# EAGLE design level-shifter (EAGLE 5.07)
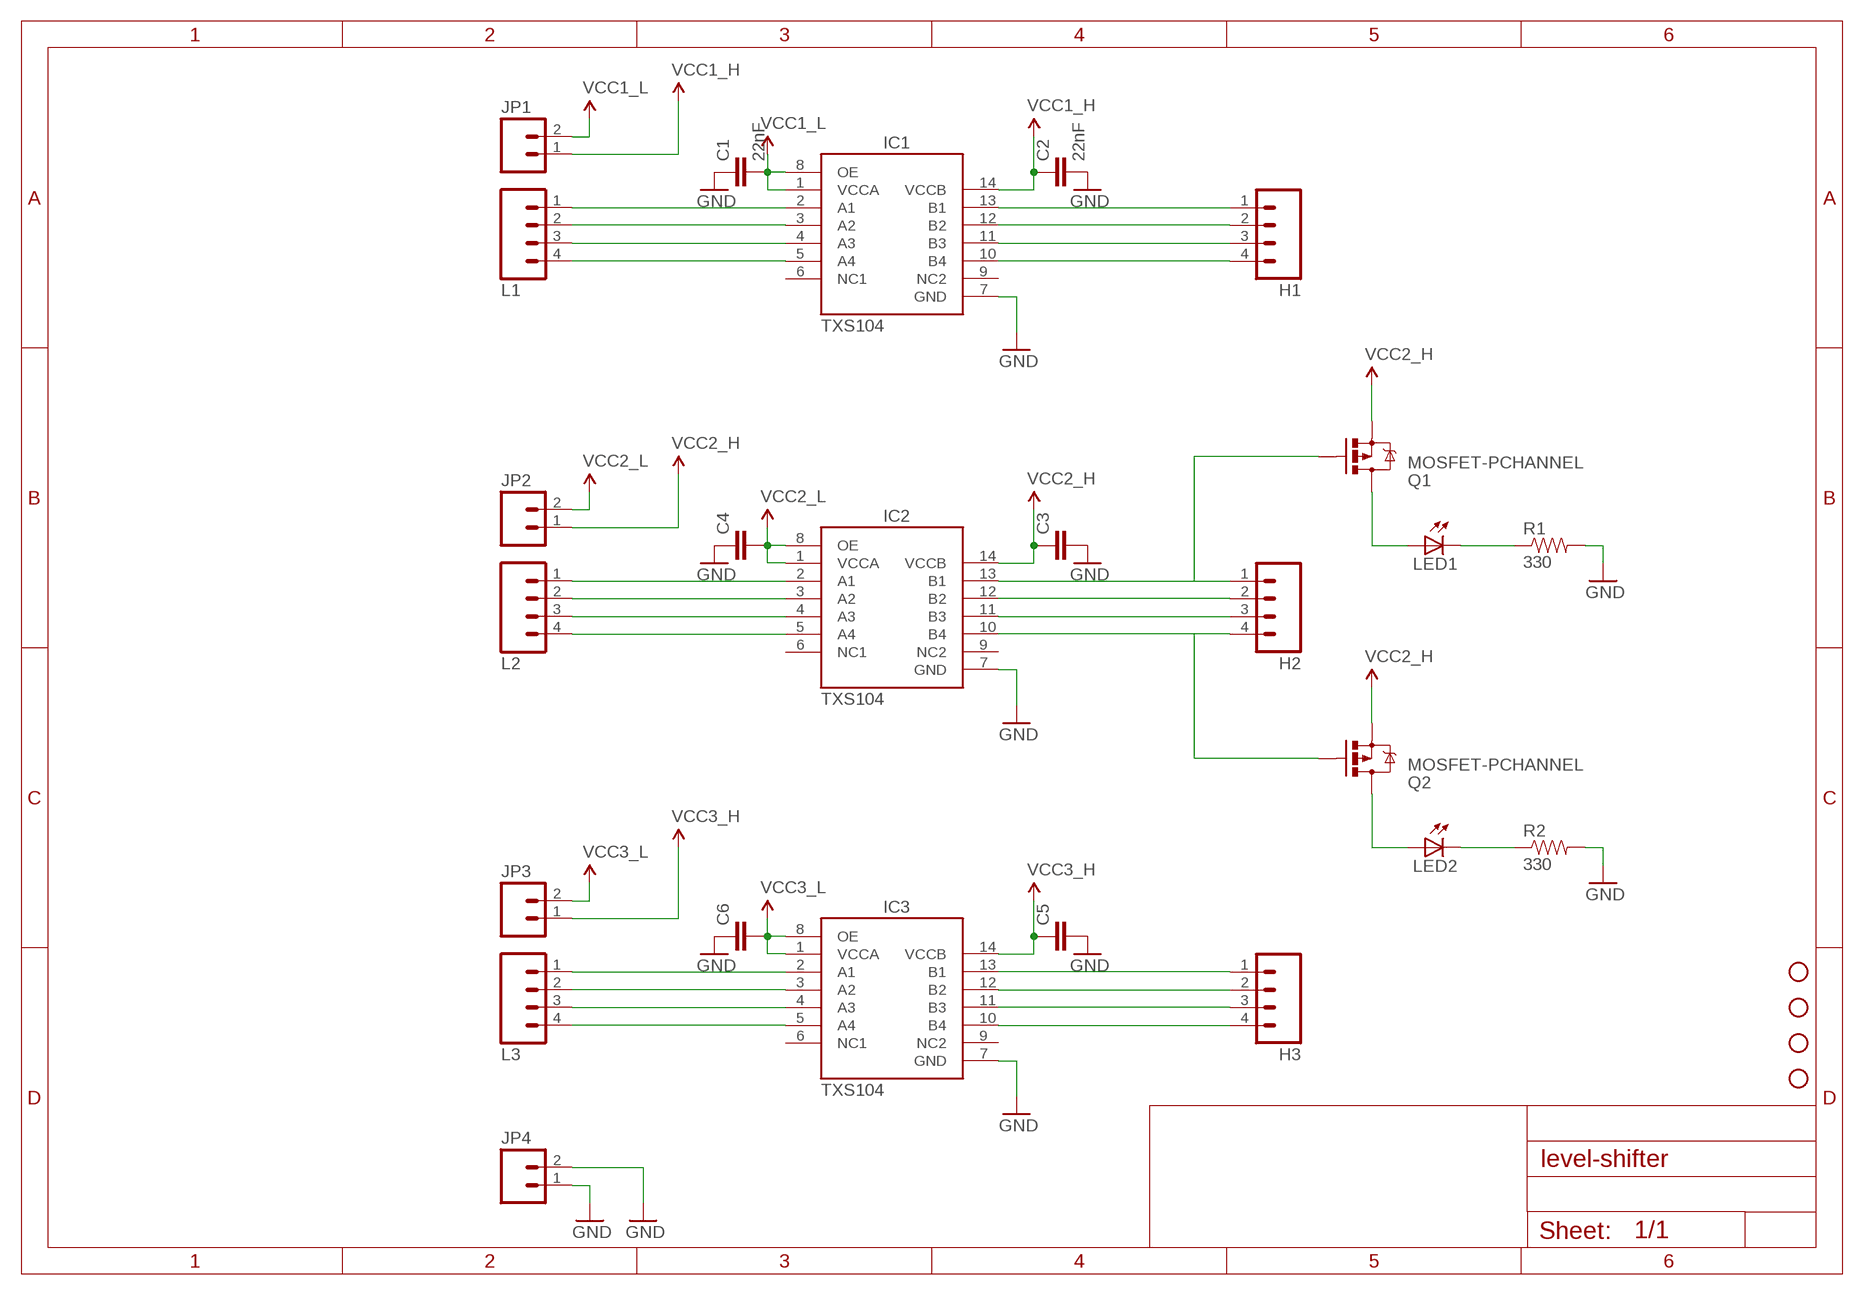
[diagram p0: schematic, sheet 1]

## Parts
C1  22nF  CAP1206  [1206]
C2  22nF  CAP1206  [1206]
C3  CAP1206  [1206]
C4  CAP1206  [1206]
C5  CAP1206  [1206]
C6  CAP1206  [1206]
H1  M04LONGPADS  [1X04_LONGPADS]
H2  M04LONGPADS  [1X04_LONGPADS]
H3  M04LONGPADS  [1X04_LONGPADS]
IC1  TXS104  [SOIC-14]
IC2  TXS104  [SOIC-14]
IC3  TXS104  [SOIC-14]
JP1  M02  [1X02_LONGPADS]
JP2  M02  [1X02_LONGPADS]
JP3  M02  [1X02_LONGPADS]
JP4  M02  [1X02_LONGPADS]
JP5  STAND-OFF  [STAND-OFF]
JP6  STAND-OFF  [STAND-OFF]
JP7  STAND-OFF  [STAND-OFF]
JP8  STAND-OFF  [STAND-OFF]
L1  M04LONGPADS  [1X04_LONGPADS]
L2  M04LONGPADS  [1X04_LONGPADS]
L3  M04LONGPADS  [1X04_LONGPADS]
LED1  LED-5MM-W  [LED-5MM-WIDE]
LED2  LED-5MM-W  [LED-5MM-WIDE]
Q1  MOSFET-PCHANNEL  [SOT23]
Q2  MOSFET-PCHANNEL  [SOT23]
R1  330  RESISTOR1206  [1206]
R2  330  RESISTOR1206  [1206]

## Nets
GND: C1.1 C2.2 C3.2 C4.1 C5.2 C6.1 IC1.7(GND) IC2.7(GND) IC3.7(GND) JP4.1 JP4.2 R1.2 R2.2
N$1: IC2.2(A1) L2.1
N$2: IC2.3(A2) L2.2
N$3: IC2.4(A3) L2.3
N$4: IC2.5(A4) L2.4
N$5: IC3.2(A1) L3.1
N$6: IC3.3(A2) L3.2
N$7: IC3.4(A3) L3.3
N$8: IC3.5(A4) L3.4
N$9: IC1.2(A1) L1.1
N$10: IC1.3(A2) L1.2
N$11: IC1.4(A3) L1.3
N$12: IC1.5(A4) L1.4
N$13: H1.1 IC1.13(B1)
N$14: H1.2 IC1.12(B2)
N$15: H1.3 IC1.11(B3)
N$16: H1.4 IC1.10(B4)
N$17: H2.1 IC2.13(B1) Q1.1(G)
N$18: H2.2 IC2.12(B2)
N$19: H2.3 IC2.11(B3)
N$20: H2.4 IC2.10(B4) Q2.1(G)
N$21: H3.1 IC3.13(B1)
N$22: H3.2 IC3.12(B2)
N$23: H3.3 IC3.11(B3)
N$24: H3.4 IC3.10(B4)
N$25: LED2.A Q2.3(D)
N$26: LED1.K(C) R1.1
N$27: LED1.A Q1.3(D)
N$28: LED2.K(C) R2.1
VCC_1_A: C1.2 IC1.1(VCCA) IC1.8(OE) JP1.2 ; supply symbol labelled VCC1_L
VCC_1_B: C2.1 IC1.14(VCCB) JP1.1 ; supply symbol labelled VCC1_H
VCC_2_A: C4.2 IC2.1(VCCA) IC2.8(OE) JP2.2 ; supply symbol labelled VCC2_L
VCC_2_B: C3.1 IC2.14(VCCB) JP2.1 Q1.2(S) Q2.2(S) ; supply symbol labelled VCC2_H
VCC_3_A: C6.2 IC3.1(VCCA) IC3.8(OE) JP3.2 ; supply symbol labelled VCC3_L
VCC_3_B: C5.1 IC3.14(VCCB) JP3.1 ; supply symbol labelled VCC3_H
Unconnected: IC1.6(NC1) IC1.9(NC2) IC2.6(NC1) IC2.9(NC2) IC3.6(NC1) IC3.9(NC2)

## Library data of the parts
C1-C6 = SparkFun:CAP: Capacitor Standard 0603 ceramic capacitor, and 0.1" leaded capacitor.
H1-H3 L1-L3 = SparkFun:M04: Header 4 Standard 4-pin 0.1" header. Use with straight break away headers (SKU : PRT-00116), right angle break away headers (PRT-00553), swiss pins (PRT-00743), machine pins (PRT-00117), and female headers (PRT-00115). Molex polarized connector foot print use with SKU : PRT-08231 with associated crimp pins and housings.
IC1-IC3 = rk_logic:TXS104
JP1-JP4 = SparkFun:M02: Header 2 Standard 2-pin 0.1" header. Use with straight break away headers (SKU : PRT-00116), right angle break away headers (PRT-00553), swiss pins (PRT-00743), machine pins (PRT-00117), and female headers (PRT-00115). Molex polarized connector foot print use with SKU : PRT-08233 with associated crimp pins and housings.
JP5-JP8 = SparkFun:STAND-OFF: Stand Off This is the mechanical footprint for a #4 phillips button head screw. Use the keepout ring to avoid running the screw head into surrounding components. SKU : PRT-00447
LED1 LED2 = rk_logic:LED-5MM-W
Q1 Q2 = SparkFun:MOSFET-PCHANNEL
R1 R2 = SparkFun:RESISTOR: Resistor Basic schematic elements and footprints for 0603, 1206, and PTH 1/10th watt (small) resistors.

## Net classes
0 default: width 0.61 mm, clearance 0.61 mm

## Board
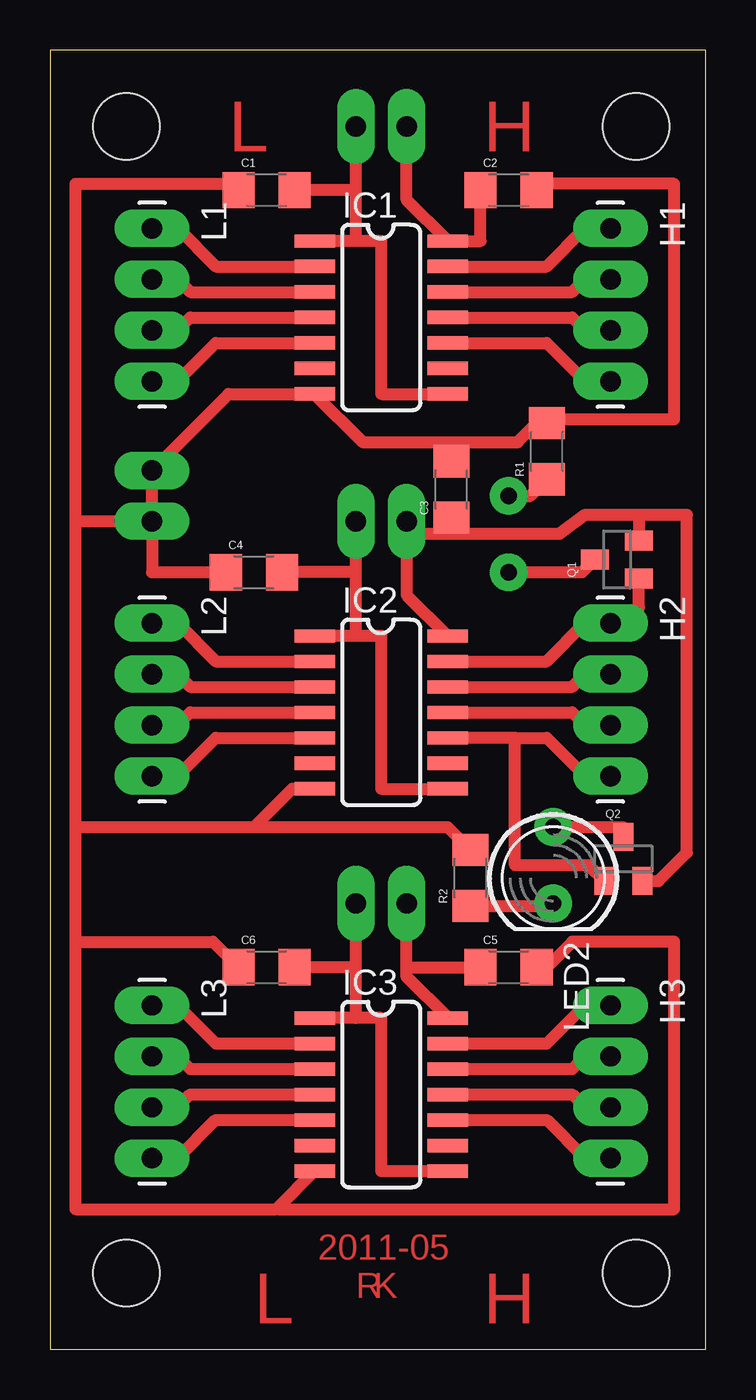
[diagram p1: board, top side]
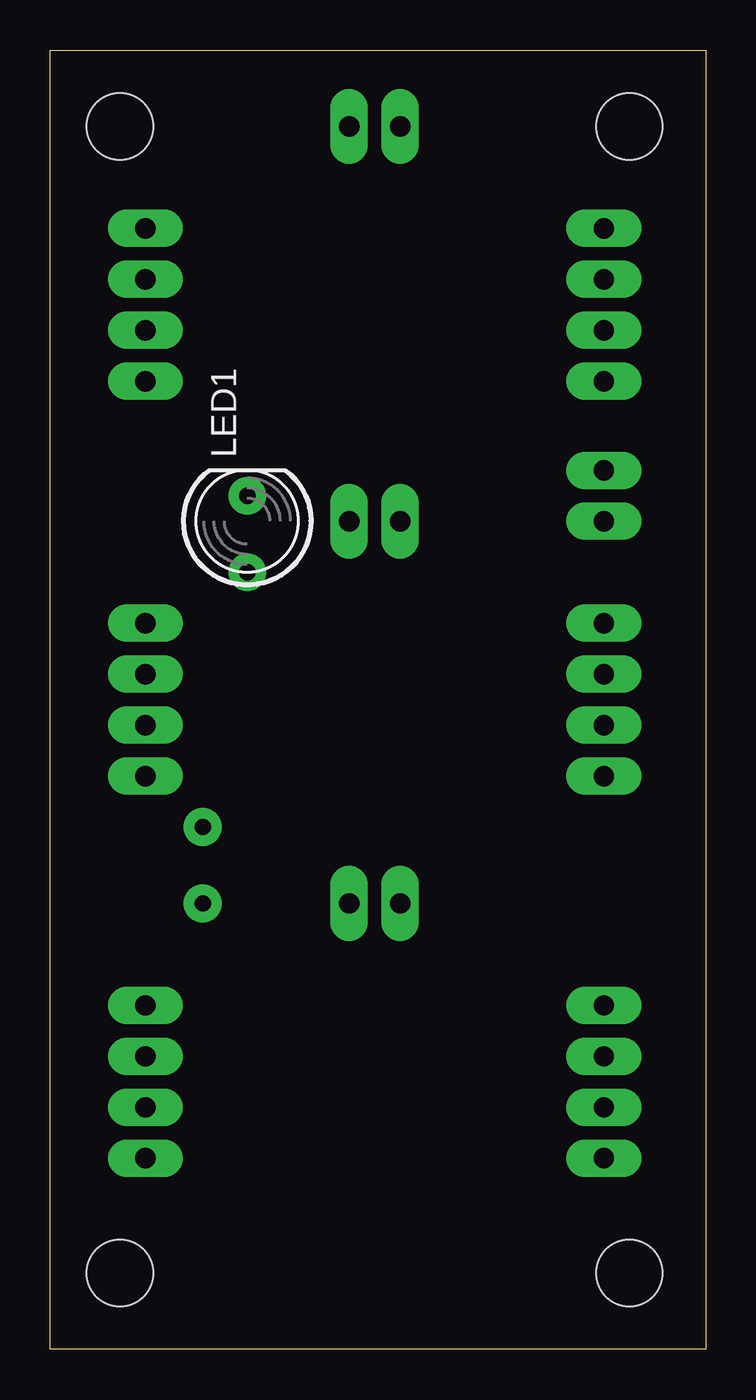
[diagram p2: board, bottom side, seen from below]

Size 32.69 x 64.76 mm. Coordinates in mm from the lower left corner, seen from the top.
Outline: 0,0 32.69,0 32.69,64.76 0,64.76 0,0
Copper layers (1*16): Top 0.035mm / dielectric 1.5mm / Bottom 0.035mm
Design rules "default": minimum track width 10mil, minimum drill 24mil, track to track 8mil, track to pad 8mil, pad to pad 8mil, via to via 8mil, smd to smd 8mil, copper to edge 40mil, drill to drill 8mil, minimum pad ring 10mil, minimum via ring 8mil, stop-mask expansion 4mil, vias tented up to drill 0mil, thermal gap 10mil

### Footprints (pad centres in the part's own frame; a part is rotated, then mirrored left to right if it is on the bottom)
1206 = smd 1.6 x 1.8: 1 -1.4,0; 2 1.4,0
1X04_LONGPADS = drill 1.016 pad 1.88 long: 1 0,0; 2 2.54,0; 3 5.08,0; 4 7.62,0
SOIC-14 = smd 0.66 x 2.032: 1 -3.175,-3.315; 2 -1.905,-3.315; 3 -0.635,-3.315; 4 0.635,-3.315; 5 1.905,-3.315; 6 3.175,-3.315; 7 4.445,-3.315; 8 4.445,3.315; 9 3.175,3.315; 10 1.905,3.315; 11 0.635,3.315; 12 -0.635,3.315; 13 -1.905,3.315; 14 -3.175,3.315
1X02_LONGPADS = drill 1.016 pad 1.88 long: 1 0,0; 2 2.54,0
STAND-OFF = hole 3.302: 0,0
LED-5MM-WIDE = drill 0.813 pad 1.88 round: A -2.54,0; K 1.27,0
SOT23 = smd 1 x 1.4: 1 -0.95,-1.1; 2 0.95,-1.1; 3 0,1.1

### Placement (x,y rotation side)
C1  10.8,57.79 0 top
C2  22.86,57.79 0 top
C3  20,42.86 90 top
C4  10.16,38.73 0 top
C5  22.86,19.05 0 top
C6  10.8,19.05 0 top
H1  27.94,55.88 270 top
H2  27.94,36.2 270 top
H3  27.94,17.14 270 top
IC1  16.51,52.07 270 top
IC2  16.51,32.38 270 top
IC3  16.51,13.34 270 top
JP1  17.78,60.96 180 top
JP2  17.78,41.28 180 top
JP3  17.78,22.22 180 top
JP4  5.08,41.28 90 top
JP5  29.21,3.81 0 top
JP6  3.81,3.81 0 top
JP7  3.81,60.96 0 top
JP8  29.21,60.96 0 top
L1  5.08,55.88 270 top
L2  5.08,36.2 270 top
L3  5.08,17.14 270 top
LED1  22.86,41.28 90 bottom
LED2  25.08,23.49 270 top
Q1  28.26,39.37 90 top
Q2  28.57,24.45 0 top
R1  24.77,44.77 90 top
R2  20.96,23.49 90 top

### Tracks (layer width: path | path; a pad name or v marks a point on that pad's centre or on a via)
GND
  Top 0.61: JP4.1 JP4.2 8.89,47.62 IC1.7 15.61,45.22 20,45.22 | 1.27,26.04 10.16,26.04 | 10.16,26.04 12.07,27.94 IC2.7 | 11.36,7.05 11.29,6.98 1.27,6.98 1.27,20.32 | 11.36,7.05 IC3.7 | 1.27,20.32 1.27,26.04 | 1.27,26.04 1.27,41.28 | 1.27,41.28 JP4.1 | C4.1 5.08,38.73 JP4.1 | C6.1 8.12,20.32 1.27,20.32 | C5.2 24.77,19.05 26.04,20.32 31.12,20.32 31.12,6.98 11.36,6.98 11.36,7.05 | 1.27,41.28 1.27,58.1 9.52,58.1 9.52,57.79 C1.1 | C2.2 24.77,57.79 24.77,58.1 31.12,58.1 31.12,46.36 24.95,46.36 R1.2 24.64,46.04 24.13,46.04 23.31,45.22 20,45.22 | R2.2 19.82,26.04 10.16,26.04 | 20,45.22 C3.2
N$1
  Top 0.61: IC2.2 8.25,34.29 6.35,36.2 L2.1
N$2
  Top 0.61: IC2.3 6.99,33.02 6.35,33.66 L2.2
N$3
  Top 0.61: IC2.4 6.99,31.75 6.35,31.11 L2.3
N$4
  Top 0.61: IC2.5 8.25,30.48 6.35,28.57 L2.4
N$5
  Top 0.61: IC3.2 8.25,15.24 6.35,17.14 L3.1
N$6
  Top 0.61: IC3.3 6.99,13.97 6.35,14.61 L3.2
N$7
  Top 0.61: IC3.4 6.99,12.7 6.35,12.07 L3.3
N$8
  Top 0.61: IC3.5 8.25,11.43 6.35,9.53 L3.4
N$9
  Top 0.61: IC1.2 8.25,53.98 6.35,55.88 L1.1
N$10
  Top 0.61: IC1.3 6.99,52.71 6.35,53.34 L1.2
N$11
  Top 0.61: IC1.4 6.99,51.44 6.35,50.8 L1.3
N$12
  Top 0.61: IC1.5 8.25,50.16 6.35,48.26 L1.4
N$13
  Top 0.61: IC1.13 24.77,53.98 26.67,55.88 H1.1
N$14
  Top 0.61: IC1.12 26.04,52.71 26.67,53.34 H1.2
N$15
  Top 0.61: IC1.11 26.04,51.44 26.67,50.8 H1.3
N$16
  Top 0.61: H1.4 26.67,48.26 24.77,50.16 IC1.10
N$17
  Top 0.61: IC2.13 24.77,34.29 26.67,36.2 H2.1 29.36,36.98 Q1.1
N$18
  Top 0.61: IC2.12 26.04,33.02 26.67,33.66 H2.2
N$19
  Top 0.61: IC2.11 26.04,31.75 26.67,31.11 H2.3
N$20
  Top 0.61: 27.3,28.57 H2.4 | 27.3,28.57 27.16,28.43 | 26.67,28.57 27.3,28.57 | 26.67,28.57 26.84,28.4 | 26.67,28.57 24.77,30.48 23.18,30.48 | 23.18,30.48 IC2.10 | Q2.1 26.84,24.13 23.18,24.13 23.18,30.48
N$21
  Top 0.61: IC3.13 24.77,15.24 26.67,17.14 H3.1
N$22
  Top 0.61: IC3.12 26.04,13.97 26.67,14.61 H3.2
N$23
  Top 0.61: IC3.11 26.04,12.7 26.67,12.07 H3.3
N$24
  Top 0.61: IC3.10 24.77,11.43 26.67,9.53 H3.4
N$25
  Top 0.61: LED2.A 28.57,26.04 Q2.3
N$26
  Top 0.61: LED1.K 23.94,42.55 R1.1
N$27
  Top 0.61: LED1.A 26.52,38.73 Q1.3
N$28
  Top 0.61: R2.1 24.95,22.09 LED2.K
VCC_1_A
  Top 0.61: 15.24,55.25 16.51,55.25 16.51,47.62 IC1.8 | 15.24,55.25 IC1.1 | 15.24,55.25 15.24,57.79 | 15.24,57.79 JP1.2 | 15.24,57.79 C1.2
VCC_1_B
  Top 0.61: JP1.1 17.78,57.29 IC1.14 21.46,55.25 C2.1
VCC_2_A
  Top 0.61: 15.24,35.56 16.51,35.56 16.51,27.94 IC2.8 | 15.24,35.56 IC2.1 | 15.24,35.56 15.24,38.73 | 15.24,38.73 JP2.2 | 15.24,38.73 C4.2
VCC_2_B
  Top 0.61: 29.53,41.59 26.67,41.59 25.4,40.64 20,40.64 | 20,40.64 18.41,40.64 arc-90 JP2.1 17.78,37.61 IC2.14 | Q2.2 30.33,23.35 31.75,24.76 31.75,41.59 29.53,41.59 | Q1.2 29.36,41.42 29.53,41.59 | 20,40.64 C3.1
VCC_3_A
  Top 0.61: 15.24,16.51 16.51,16.51 16.51,8.89 IC3.8 | 15.24,16.51 IC3.1 | 15.24,16.51 15.24,19.05 | 15.24,19.05 JP3.2 | 15.24,19.05 C6.2
VCC_3_B
  Top 0.61: 17.78,19.05 17.78,18.55 IC3.14 | 17.78,19.05 JP3.1 | 17.78,19.05 C5.1

### Text on the board
Top: L | H | 2011-05 | R | K | L | H